# EAGLE design morse_lora_v3 (EAGLE 9.6.2)
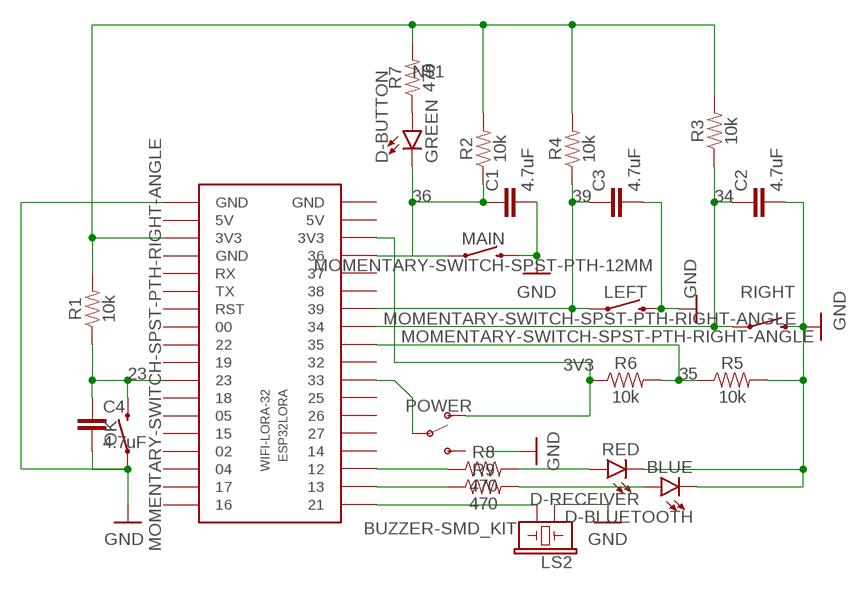
[diagram p0: schematic, sheet 1]

## Parts
C1  4.7uF  4.7UF-0603-6.3V-(10%)  [0603]
C2  4.7uF  4.7UF-0603-6.3V-(10%)  [0603]
C3  4.7uF  4.7UF-0603-6.3V-(10%)  [0603]
C4  4.7uF  4.7UF-0603-6.3V-(10%)  [0603]
D-BLUETOOTH  BLUE  LED-BLUE1206  [LED-1206]
D-BUTTON  GREEN  LED-GREEN1206  [LED-1206]
D-RECEIVER  RED  LED-RED1206  [LED-1206]
ESP32LORA  WIFI-LORA-32  [2.54MM_2X18]
LEFT  MOMENTARY-SWITCH-SPST-PTH-RIGHT-ANGLE  [TACTILE_SWITCH_PTH_RIGHT_ANGLE]
LS2  BUZZER-SMD_KIT  [BUZZER-CCV-KIT]
MAIN  MOMENTARY-SWITCH-SPST-PTH-12MM  [TACTILE_SWITCH_PTH_12MM]
OK  MOMENTARY-SWITCH-SPST-PTH-RIGHT-ANGLE  [TACTILE_SWITCH_PTH_RIGHT_ANGLE]
POWER  SWITCH-SPDT-SMD-RIGHT-ANGLE  [SWITCH_SPST_SMD_A]
R1  10k  10KOHM-0603-1/10W-1%  [0603]
R2  10k  10KOHM-0603-1/10W-1%  [0603]
R3  10k  10KOHM-0603-1/10W-1%  [0603]
R4  10k  10KOHM-0603-1/10W-1%  [0603]
R5  10k  10KOHM-0603-1/10W-1%  [0603]
R6  10k  10KOHM-0603-1/10W-1%  [0603]
R7  470  470OHM-0603-1/10W-1%  [0603]
R8  470  470OHM-0603-1/10W-1%  [0603]
R9  470  470OHM-0603-1/10W-1%  [0603]
RIGHT  MOMENTARY-SWITCH-SPST-PTH-RIGHT-ANGLE  [TACTILE_SWITCH_PTH_RIGHT_ANGLE]

## Nets
3V3: ESP32LORA.P$3(3V3) ESP32LORA.P$34(3V3) POWER.1(O) R1.2 R2.2 R3.2 R4.2 R6.1 R7.2
23: C4.1 ESP32LORA.P$11 OK.2 R1.1
34: C2.1 ESP32LORA.P$29 R3.1 RIGHT.1
35: ESP32LORA.P$28 R5.1 R6.2
36: C1.1 D-BUTTON.C ESP32LORA.P$33 MAIN.1 R2.1
39: C3.1 ESP32LORA.P$30 LEFT.1 R4.1
GND: C1.2 C2.2 C3.2 C4.2 D-BLUETOOTH.C D-RECEIVER.C ESP32LORA.P$1(GND) LEFT.2 LS2.+ MAIN.3 OK.1 R5.2 RIGHT.2
N$1: D-BUTTON.A R7.1
N$2: D-RECEIVER.A R8.2
N$3: ESP32LORA.P$20 R9.1
N$4: ESP32LORA.P$19 LS2.-
N$5: ESP32LORA.P$21 R8.1
N$6: D-BLUETOOTH.A R9.2
N$13: ESP32LORA.P$26 POWER.2(P)
Unconnected: ESP32LORA.P$2(5V) ESP32LORA.P$4(GND) ESP32LORA.P$5(RX) ESP32LORA.P$6(TX) ESP32LORA.P$7(RST) ESP32LORA.P$8 ESP32LORA.P$9 ESP32LORA.P$10 ESP32LORA.P$12 ESP32LORA.P$13 ESP32LORA.P$14 ESP32LORA.P$15 ESP32LORA.P$16 ESP32LORA.P$17 ESP32LORA.P$18 ESP32LORA.P$22 ESP32LORA.P$23 ESP32LORA.P$24 ESP32LORA.P$25 ESP32LORA.P$27 ESP32LORA.P$31 ESP32LORA.P$32 ESP32LORA.P$35(5V) ESP32LORA.P$36(GND) POWER.3(S)

## Library data of the parts
C1-C4 = SparkFun-Capacitors:4.7UF: 4.7µF ceramic capacitors A capacitor is a passive two-terminal electrical component used to store electrical energy temporarily in an electric field.; PROD_ID: CAP-08280
D-BLUETOOTH = SparkFun-LED:LED-BLUE: Blue SMD LED Used in manufacturing of various products at SparkFun Packages: 0603 - SMD 0603 package [Product Link] <http://www.digikey.com/product-detail/en/SMLE12BC7TT86/511-1589-2-ND/1641808> 1206 - SMD1206 package [Product Link] <http://www.digikey.com/product-detail/en/lite-on-inc/LTST-C150TBKT/160-1643-1-ND/573584> SparkFun Products: ESP8266 Thing-Dev Board <https://www.sparkfun.com/products/13711> RedBoard <https://www.sparkfun.com/products/12757>; PROD_ID: DIO-09911
D-BUTTON = SparkFun-LED:LED-GREEN: Green SMD LED Used in manufacturing of various products at SparkFun Packages: 0603 - SMD 0603 package [Product Link] <http://www.futureelectronics.com/en/technologies/semiconductors/optoelectronics/leds/Pages/9894312-LTST-C190GKT.aspx?CrossPart=HSMG-C190&IM=0> LilyPad 1206 - SMD1206 LilyPad package [Product Link] <http://www.futureelectronics.com/en/Technologies/Product.aspx?ProductID=IN150NGHARVATEKCORPORATION2049943&IM=0> 1206 - SMD1206 package [Product Link] <http://www.futureelectronics.com/en/technologies/semiconductors/optoelectronics/leds/Pages/8315665-LTST-C150KGKT.aspx?IM=0> 1206 Bottom Mount -SMD 1206 Bottom Mount [Product Link] <http://www.digikey.com/product-detail/en/lite-on-inc/LTST-C230KGKT/160-1456-1-ND/386854> SparkFun Products: Pro Mini 328 -5V <https://www.sparkfun.com/products/821> RedBoard <https://www.sparkfun.com/products/12757> MP3 Trigger <https://www.sparkfun.com/products/13720> Makey Makey <https://www.sparkfun.com/products/11076>; PROD_ID: DIO-00862
D-RECEIVER = SparkFun-LED:LED-RED: Red SMD LED Used in manufacturing of most products at SparkFun Packages: 0603 - SMD 0603 package [Product Link] <http://docs.avagotech.com/docs/AV02-0551EN> 0603 SMART - SMD 0603 SMART package ( more efficient and expensive)[Product Link] <http://www.osram-os.com/Graphics/XPic2/00077099_0.pdf> 1206 - SMD1206 package [Product Link] <https://www.sparkfun.com/datasheets/DevTools/LilyPad/Q150OVS4.pdff> SparkFun Products: Pro Mini 328 -5V <https://www.sparkfun.com/products/821> RedBoard <https://www.sparkfun.com/products/12757> IOIO-OTG <https://www.sparkfun.com/products/13613>; PROD_ID: DIO-09912
ESP32LORA = ESP32_modules:WIFI-LORA-32
LEFT OK RIGHT = SparkFun-Switches:MOMENTARY-SWITCH-SPST: Momentary Switch (Pushbutton) - SPST Normally-open (NO) SPST momentary switches (buttons, pushbuttons). Variants PTH-12MM - 12mm square, through-hole Momentary Pushbutton Switch - 12mm Square <https://www.sparkfun.com/products/9190> (COM-09190) PTH-6.0MM, PTH-6.0MM-KIT - 6.0mm square, through-hole Mini Pushbutton Switch <https://www.sparkfun.com/products/97> (COM-00097) KIT package intended for soldering kit's - only one side of pads' copper is exposed. PTH-RIGHT-ANGLE-KIT - Right-angle, through-hole Right Angle Tactile Button <https://www.sparkfun.com/products/10791> - Used on SparkFun BigTime Watch Kit <https://www.sparkfun.com/products/11734> SMD-12MM - 12mm square, surface-mount Tactile Button - SMD (12mm) <https://www.sparkfun.com/products/12993> (COM-12993) Used on SparkFun PicoBoard <https://www.sparkfun.com/products/11888> SMD-4.5MM - 4.5mm Square Trackball Switch Used on SparkFun Blackberry Trackballer Breakout <https://www.sparkfun.com/products/13169> SMD-4.6MMX2.8MM - 4.60mm x 2.80mm, surface mount Used on SparkFun SAMD21 Mini Breakout <https://www.sparkfun.com/products/13664> SMD-5.2MM, SMD-5.2-REDUNDANT - 5.2mm square, surface-mount Mini Pushbutton Switch - SMD <https://www.sparkfun.com/products/8720> (COM-08720) Used on Arduino Pro Mini <https://www.sparkfun.com/products/11114> REDUNDANT package connects both switch circuits together SMD-6.0X3.5MM - 6.0 x 3.5mm, surface mount Momentary Reset Switch SMD <https://www.sparkfun.com/products/8229> (COM-08229) SMD-6.2MM-TALL - 6.2mm square, surface mount Tactile Button - SMD (6mm) <https://www.sparkfun.com/products/12992> Used on SparkFun Digital Sandbox <https://www.sparkfun.com/products/12651> SMD-RIGHT-ANGLE - Right-angle, surface mount Used on SparkFun Block for Intel® Edison - Arduino <https://www.sparkfun.com/products/13036>; PROD_ID: CONN-10672; SF_SKU: COM-10791
LS2 = SparkFun-Electromechanical:BUZZER: Buzzer Small round buzzers that operate around the audible 2kHz range. You can use these as speakers to create simple music or user interfaces. Variant Overview: PTH - Mini Speaker - PC Mount 12mm 2.048kHz <https://www.sparkfun.com/products/7950> PTH_KIT - Mini Speaker - PC Mount 12mm 2.048kHz <https://www.sparkfun.com/products/7950> KIT simplifies soldering by adding stop mask to one side of the pads. PTH_NO_SILK - Mini Speaker - PC Mount 12mm 2.048kHz <https://www.sparkfun.com/products/7950> No silkscreen indicator of buzzer outline. PTH_KIT_NO_SILK - Mini Speaker - PC Mount 12mm 2.048kHz <https://www.sparkfun.com/products/7950> KIT package w/o silkscreen SMD - Buzzer Audio Magnetic (CCV-084B16) SMD buzzer used on, e.g. the LilyPad Buzzer <https://www.sparkfun.com/products/8463> and RFID USB Reader <https://www.sparkfun.com/products/9963>. SMD_KIT - Buzzer Audio Magnetic (CCV-084B16) SMD Buzzer with elongated pins to make soldering easier. Used on the SparkFun Simon Says - Surface Mount Soldering Kit <https://www.sparkfun.com/products/10935>.; PROD_ID: COMP-08568
MAIN = SparkFun-Switches:MOMENTARY-SWITCH-SPST: Momentary Switch (Pushbutton) - SPST Normally-open (NO) SPST momentary switches (buttons, pushbuttons). Variants PTH-12MM - 12mm square, through-hole Momentary Pushbutton Switch - 12mm Square <https://www.sparkfun.com/products/9190> (COM-09190) PTH-6.0MM, PTH-6.0MM-KIT - 6.0mm square, through-hole Mini Pushbutton Switch <https://www.sparkfun.com/products/97> (COM-00097) KIT package intended for soldering kit's - only one side of pads' copper is exposed. PTH-RIGHT-ANGLE-KIT - Right-angle, through-hole Right Angle Tactile Button <https://www.sparkfun.com/products/10791> - Used on SparkFun BigTime Watch Kit <https://www.sparkfun.com/products/11734> SMD-12MM - 12mm square, surface-mount Tactile Button - SMD (12mm) <https://www.sparkfun.com/products/12993> (COM-12993) Used on SparkFun PicoBoard <https://www.sparkfun.com/products/11888> SMD-4.5MM - 4.5mm Square Trackball Switch Used on SparkFun Blackberry Trackballer Breakout <https://www.sparkfun.com/products/13169> SMD-4.6MMX2.8MM - 4.60mm x 2.80mm, surface mount Used on SparkFun SAMD21 Mini Breakout <https://www.sparkfun.com/products/13664> SMD-5.2MM, SMD-5.2-REDUNDANT - 5.2mm square, surface-mount Mini Pushbutton Switch - SMD <https://www.sparkfun.com/products/8720> (COM-08720) Used on Arduino Pro Mini <https://www.sparkfun.com/products/11114> REDUNDANT package connects both switch circuits together SMD-6.0X3.5MM - 6.0 x 3.5mm, surface mount Momentary Reset Switch SMD <https://www.sparkfun.com/products/8229> (COM-08229) SMD-6.2MM-TALL - 6.2mm square, surface mount Tactile Button - SMD (6mm) <https://www.sparkfun.com/products/12992> Used on SparkFun Digital Sandbox <https://www.sparkfun.com/products/12651> SMD-RIGHT-ANGLE - Right-angle, surface mount Used on SparkFun Block for Intel® Edison - Arduino <https://www.sparkfun.com/products/13036>; PROD_ID: SWCH-09185; SF_SKU: COM-09190
POWER = SparkFun-Switches:SWITCH-SPDT: Single Pole, Double Throw (SPDT) Switch Single-pole, double-throw (SPDT) switch. Variant Overview SMD-AYZ0202 Surface Mount DPDT Switch <https://www.sparkfun.com/products/597> (COM-00597) Used on e.g. LilyPad Arduino USB - ATmega32U4 Board <https://www.sparkfun.com/products/12049> PTH-11.6X4.0MM SPDT Mini Power Switch <https://www.sparkfun.com/products/102> (COM-00102) Used on e.g. SparkFun Simon Says - Through-Hole Soldering Kit <https://www.sparkfun.com/products/10547> (KIT-10547) PTH-11.6X4.0MM-KIT KIT version of SPDT Mini Power Switch - Simplifies soldering by removing tStop of switch pins - only one side can be soldered. PTH-11.6X4.0MM-LOCK LOCK version of SPDT Mini Power Switch - Offset pins hold switch in place for easier soldering. SMD-RIGHT-ANGLE Surface Mount Right Angle Switch <https://www.sparkfun.com/products/10860> (COM-10860) Used on e.g. SparkFun ESP8266 Thing <https://www.sparkfun.com/products/13231>; PROD_ID: SWCH-10651; SF_SKU: COM-10860
R1-R6 = SparkFun-Resistors:10KOHM: 10kΩ resistor A resistor is a passive two-terminal electrical component that implements electrical resistance as a circuit element. Resistors act to reduce current flow, and, at the same time, act to lower voltage levels within circuits. - Wikipedia; PROD_ID: RES-00824
R7-R9 = SparkFun-Resistors:470OHM: 470Ω resistor A resistor is a passive two-terminal electrical component that implements electrical resistance as a circuit element. Resistors act to reduce current flow, and, at the same time, act to lower voltage levels within circuits. - Wikipedia; PROD_ID: RES-07869

## Board
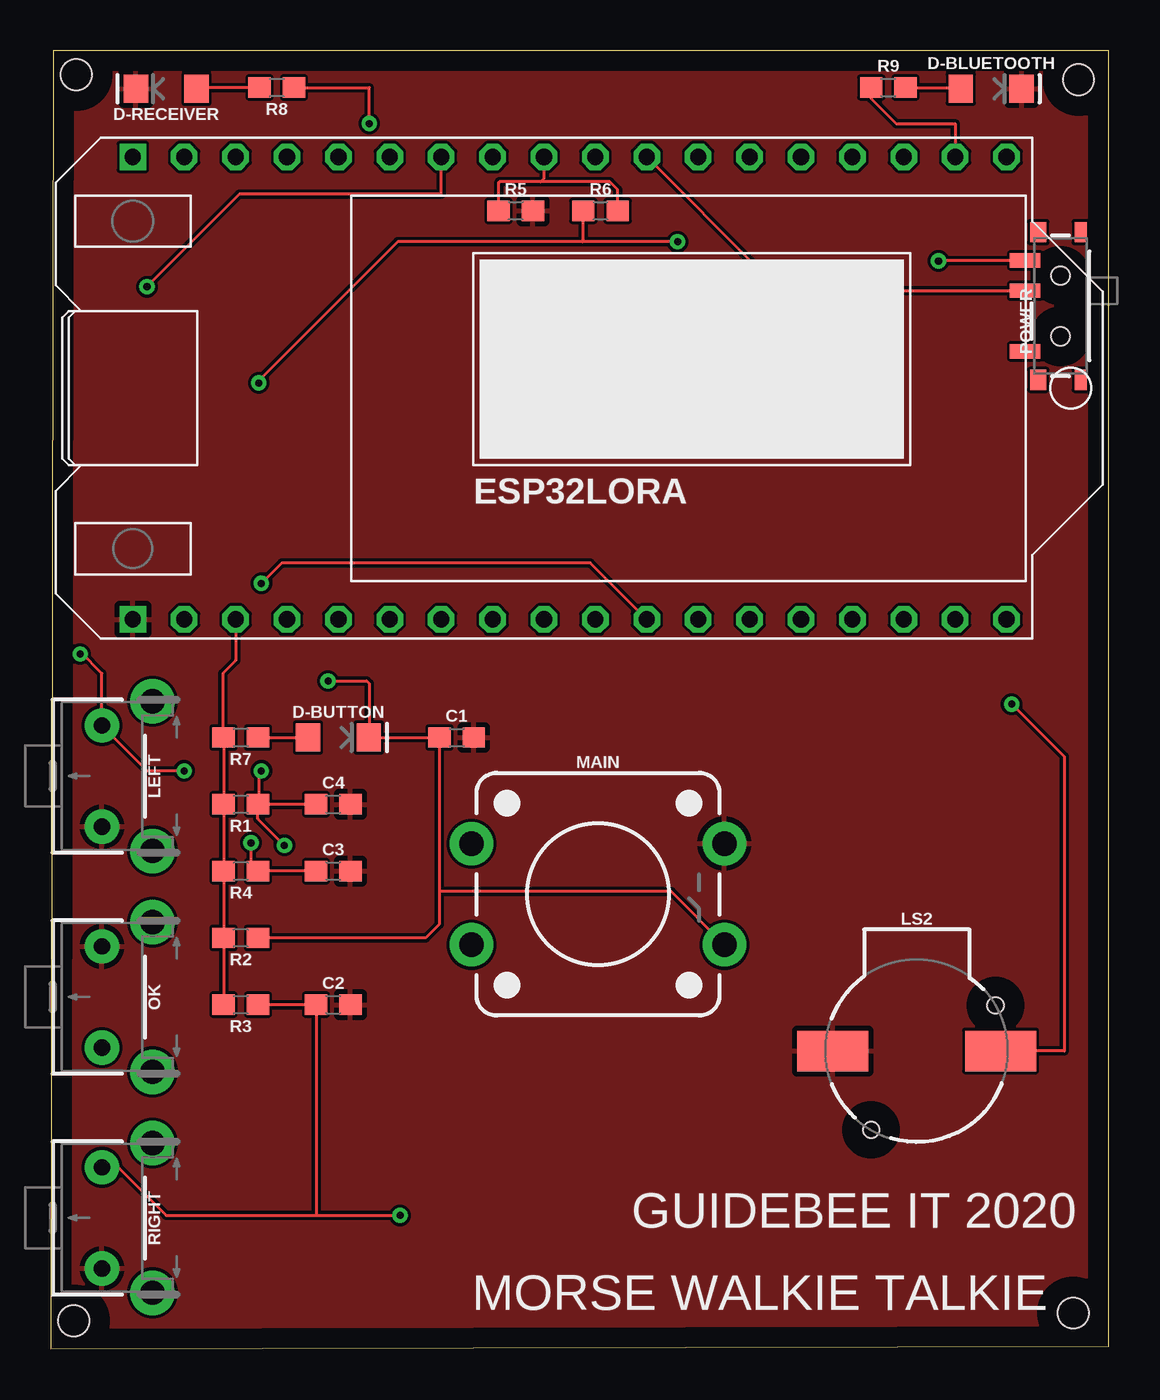
[diagram p1: board, top side]
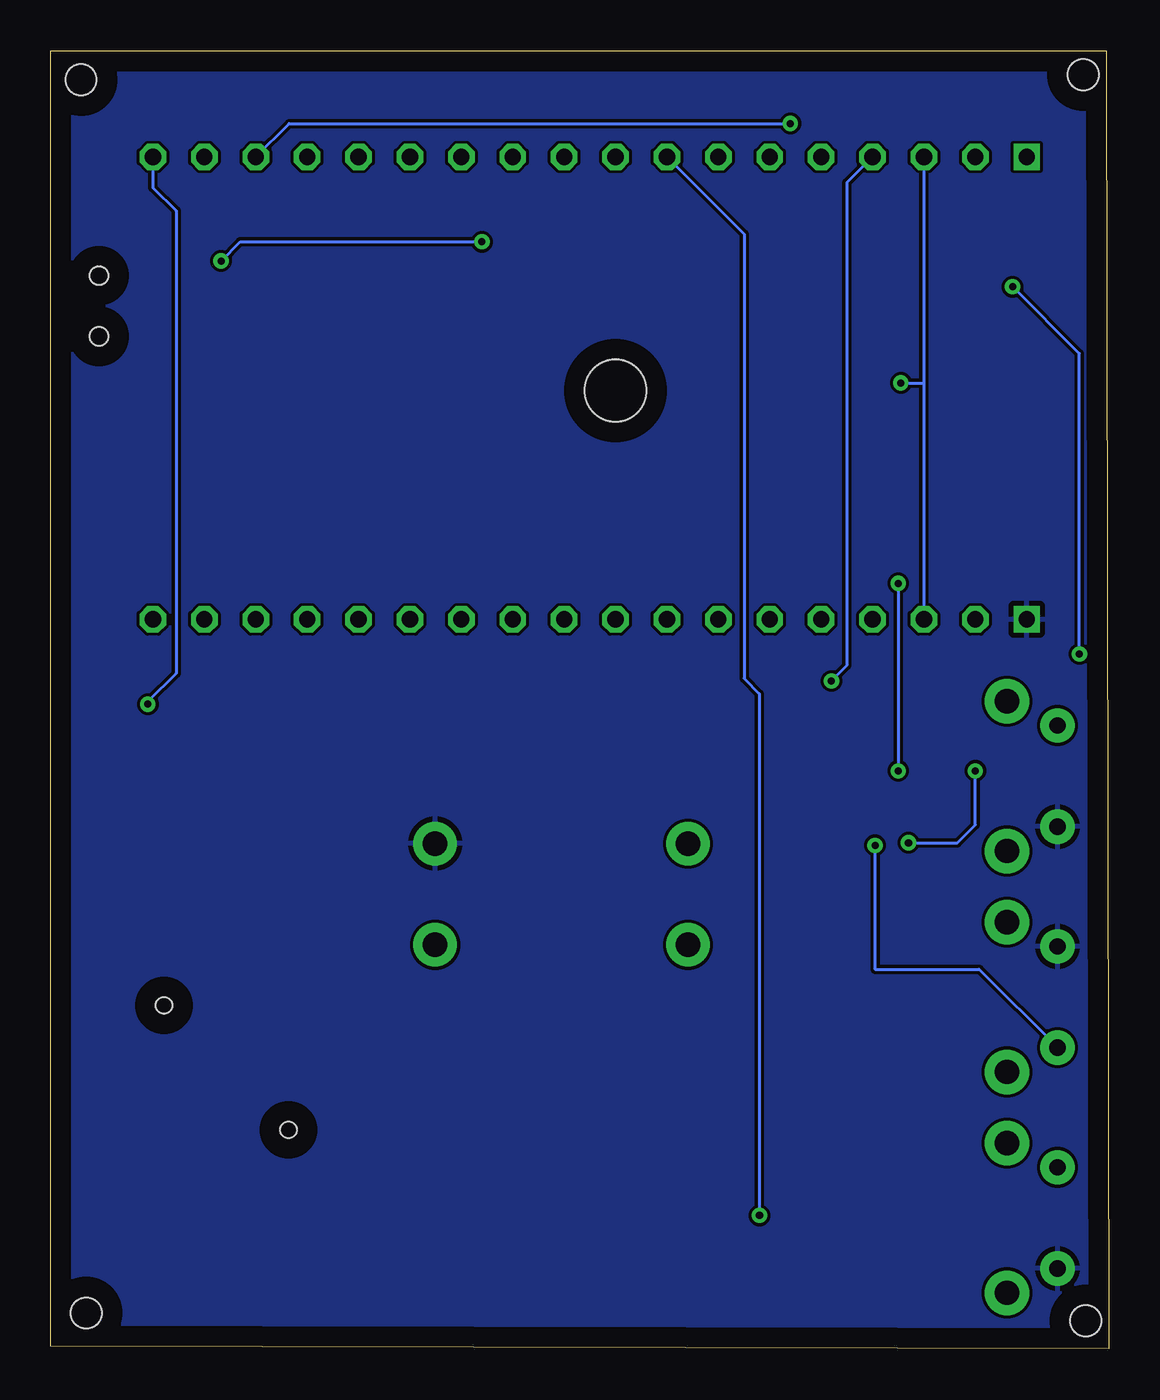
[diagram p2: board, bottom side, seen from below]

Size 52.3 x 64.19 mm. Coordinates in mm from the lower left corner, seen from the top.
Outline: 0,0 52.3,0.13 52.3,64.19 0.13,64.19 0,0
Copper layers (1*16): Top 0.035mm / dielectric 1.5mm / Bottom 0.035mm
Design rules "default *": minimum track width 6mil, minimum drill 0.35mm, track to track 6mil, track to pad 6mil, pad to pad 6mil, via to via 6mil, smd to smd 6mil, copper to edge 40mil, drill to drill 6mil, minimum pad ring 10mil, minimum via ring 8mil, stop-mask expansion 4mil, vias tented up to drill 0mil, thermal gap 10mil
Holes 3.05 mm at 24.38,47.37
Holes 1.52 mm at 1.27,62.99 50.8,62.74 50.55,1.78 1.14,1.4

### Footprints (pad centres in the part's own frame; a part is rotated, then mirrored left to right if it is on the bottom)
0603 = smd 1.1 x 1: 1 -0.85,0; 2 0.85,0
LED-1206 = smd 1.2 x 1.4: A -1.5,0; C 1.5,0
2.54MM_2X18 = drill 0.8 square: P$1 -20.32,-11.43; P$36 -20.32,11.43 | drill 0.8 octagon: P$2 -17.78,-11.43; P$3 -15.24,-11.43; P$4 -12.7,-11.43; P$5 -10.16,-11.43; P$6 -7.62,-11.43; P$7 -5.08,-11.43; P$8 -2.54,-11.43; P$9 0,-11.43; P$10 2.54,-11.43; P$11 5.08,-11.43; P$12 7.62,-11.43; P$13 10.16,-11.43; P$14 12.7,-11.43; P$15 15.24,-11.43; P$16 17.78,-11.43; P$17 20.32,-11.43; P$18 22.86,-11.43; P$19 22.86,11.43; P$20 20.32,11.43; P$21 17.78,11.43; P$22 15.24,11.43; P$23 12.7,11.43; P$24 10.16,11.43; P$25 7.62,11.43; P$26 5.08,11.43; P$27 2.54,11.43; P$28 0,11.43; P$29 -2.54,11.43; P$30 -5.08,11.43; P$31 -7.62,11.43; P$32 -10.16,11.43; P$33 -12.7,11.43; P$34 -15.24,11.43; P$35 -17.78,11.43
TACTILE_SWITCH_PTH_RIGHT_ANGLE = drill 0.8 pad 1.7: 1 -2.5,0; 2 2.5,0 | drill 1.2 pad 2.2: ANCHOR1 -3.703,2.5; ANCHOR2 3.703,2.5
BUZZER-CCV-KIT = smd 3.5 x 2: + 4.15,0; - -4.15,0 | hole 0.8: -3.9,-2.25; 2.25,3.9
TACTILE_SWITCH_PTH_12MM = drill 1.2 pad 2.159: 1 6.25,-2.5; 2 -6.25,-2.5; 3 6.25,2.5; 4 -6.25,2.5
SWITCH_SPST_SMD_A = smd 0.7 x 1.5: 1 -2.25,-1.75; 2 -0.75,-1.75; 3 2.25,-1.75 | smd 1 x 0.6: GND1 -3.65,1; GND3 3.65,1 | smd 1 x 0.8: GND2 -3.65,-1.1; GND4 3.65,-1.1 | hole 0.9: -1.5,0; 1.5,0

### Placement (x,y rotation side)
C1  20.07,30.23 0 top
C2  13.97,17.02 0 top
C3  13.97,23.62 0 top
C4  13.97,26.92 0 top
D-BLUETOOTH  46.48,62.3 0 top
D-BUTTON  14.22,30.23 0 top
D-RECEIVER  5.71,62.3 180 top
ESP32LORA  24.38,47.5 0 top
LEFT  2.54,28.32 270 top
LS2  42.8,14.73 180 top
MAIN  27.05,22.48 0 top
OK  2.54,17.4 270 top
POWER  49.91,51.56 270 top
R1  9.4,26.92 180 top
R2  9.4,20.32 180 top
R3  9.4,17.02 180 top
R4  9.4,23.62 180 top
R5  22.99,56.26 0 top
R6  27.18,56.26 0 top
R7  9.4,30.23 180 top
R8  11.18,62.36 180 top
R9  41.4,62.36 0 top
RIGHT  2.54,6.48 270 top

### Tracks (layer width: path | path; a pad name or v marks a point on that pad's centre or on a via)
3V3  (via drill 0.35)
  Top 0.152: ESP32LORA.P$3 9.14,34.04 8.51,33.4 8.51,30.27 R7.2 R1.2 R4.2 R2.2 R3.2 | POWER.1 44.16,53.81 44.01,53.66 v43.88,53.78 | v30.99,54.74 26.29,54.74 | R6.1 26.33,54.78 26.29,54.74 | 26.29,54.74 17.14,54.74 10.29,47.88 v10.29,47.75
  Bottom 0.152: ESP32LORA.P$34 9.14,47.75 | 9.14,47.75 ESP32LORA.P$3 | v43.88,53.78 42.93,54.74 v30.99,54.74 | v10.29,47.75 9.14,47.75
23  (via drill 0.35)
  Top 0.152: v11.56,24.89 10.25,26.2 R1.1 10.29,26.92 | C4.1 10.29,26.92 | ESP32LORA.P$11 26.67,38.86 11.43,38.86 v10.41,37.85 | v10.41,28.58 10.29,28.45 10.29,26.92
  Bottom 0.152: OK.2 6.41,18.77 11.56,18.77 v11.56,24.89 | v10.41,37.85 v10.41,28.58
34  (via drill 0.35)
  Top 0.152: R3.1 C2.1 13.12,6.64 13.08,6.6 | RIGHT.1 3.34,8.98 5.71,6.6 13.08,6.6 | 13.08,6.6 v17.27,6.6
  Bottom 0.152: ESP32LORA.P$29 18.03,55.12 18.03,33.15 17.27,32.38 v17.27,6.6
35
  Top 0.152: R5.1 22.14,57.66 22.18,57.7 24.21,57.7 | 24.21,57.7 24.38,57.87 ESP32LORA.P$28 | R6.2 28.03,57.32 27.64,57.7 24.21,57.7
36  (via drill 0.35)
  Top 0.152: v13.72,33.02 15.62,33.02 15.75,32.89 15.75,30.25 D-BUTTON.C C1.1 19.22,22.61 | 19.22,22.61 19.22,20.99 18.54,20.32 R2.1 | MAIN.1 30.67,22.61 19.22,22.61
  Bottom 0.152: ESP32LORA.P$33 12.95,57.66 12.95,33.79 v13.72,33.02
39  (via drill 0.35)
  Top 0.152: C3.1 R4.1 9.91,23.96 v9.91,25.02 | v6.6,28.58 4.79,28.58 LEFT.1 2.54,33.4 1.52,34.42 v1.46,34.36 v1.46,34.35 | v4.76,52.52 9.33,57.09 19.3,57.09 ESP32LORA.P$30
  Bottom 0.152: v9.91,25.02 7.49,25.02 6.6,25.91 v6.6,28.58 | v1.46,34.35 1.46,49.21 v4.76,52.52
GND
  pour Top: 0.13,64.13 52.2,64.13 52.2,63.88 52.2,0.25 52.07,0.25 0,0.25
  pour Bottom: 0,0.13 52.07,0.13 52.07,0.38 52.07,64.01 51.94,64.01 0.13,64.01 0.13,63.88
N$1
  Top 0.152: R7.1 D-BUTTON.A
N$2
  Top 0.152: D-RECEIVER.A 7.27,62.36 R8.2
N$3
  Top 0.152: R9.1 40.55,61.81 41.78,60.58 44.7,60.58 ESP32LORA.P$20
N$4  (via drill 0.35)
  Top 0.152: v47.5,31.88 50.1,29.28 50.1,14.73 LS2.-
  Bottom 0.152: ESP32LORA.P$19 47.24,57.4 46.1,56.26 46.1,33.4 47.5,32 v47.5,31.88
N$5  (via drill 0.35)
  Top 0.152: v15.75,60.58 15.75,62.36 R8.1
  Bottom 0.152: ESP32LORA.P$21 40.51,60.58 v15.75,60.58
N$6
  Top 0.152: R9.2 44.92,62.36 D-BLUETOOTH.A
N$13
  Top 0.152: ESP32LORA.P$26 35.05,53.34 35.05,52.32 35.06,52.31 POWER.2

### Text on the board
tNames: GUIDEBEE IT 2020 | MORSE WALKIE TALKIE